# Altium schematic sheet electronic_stopwatch.SchDoc
size A4
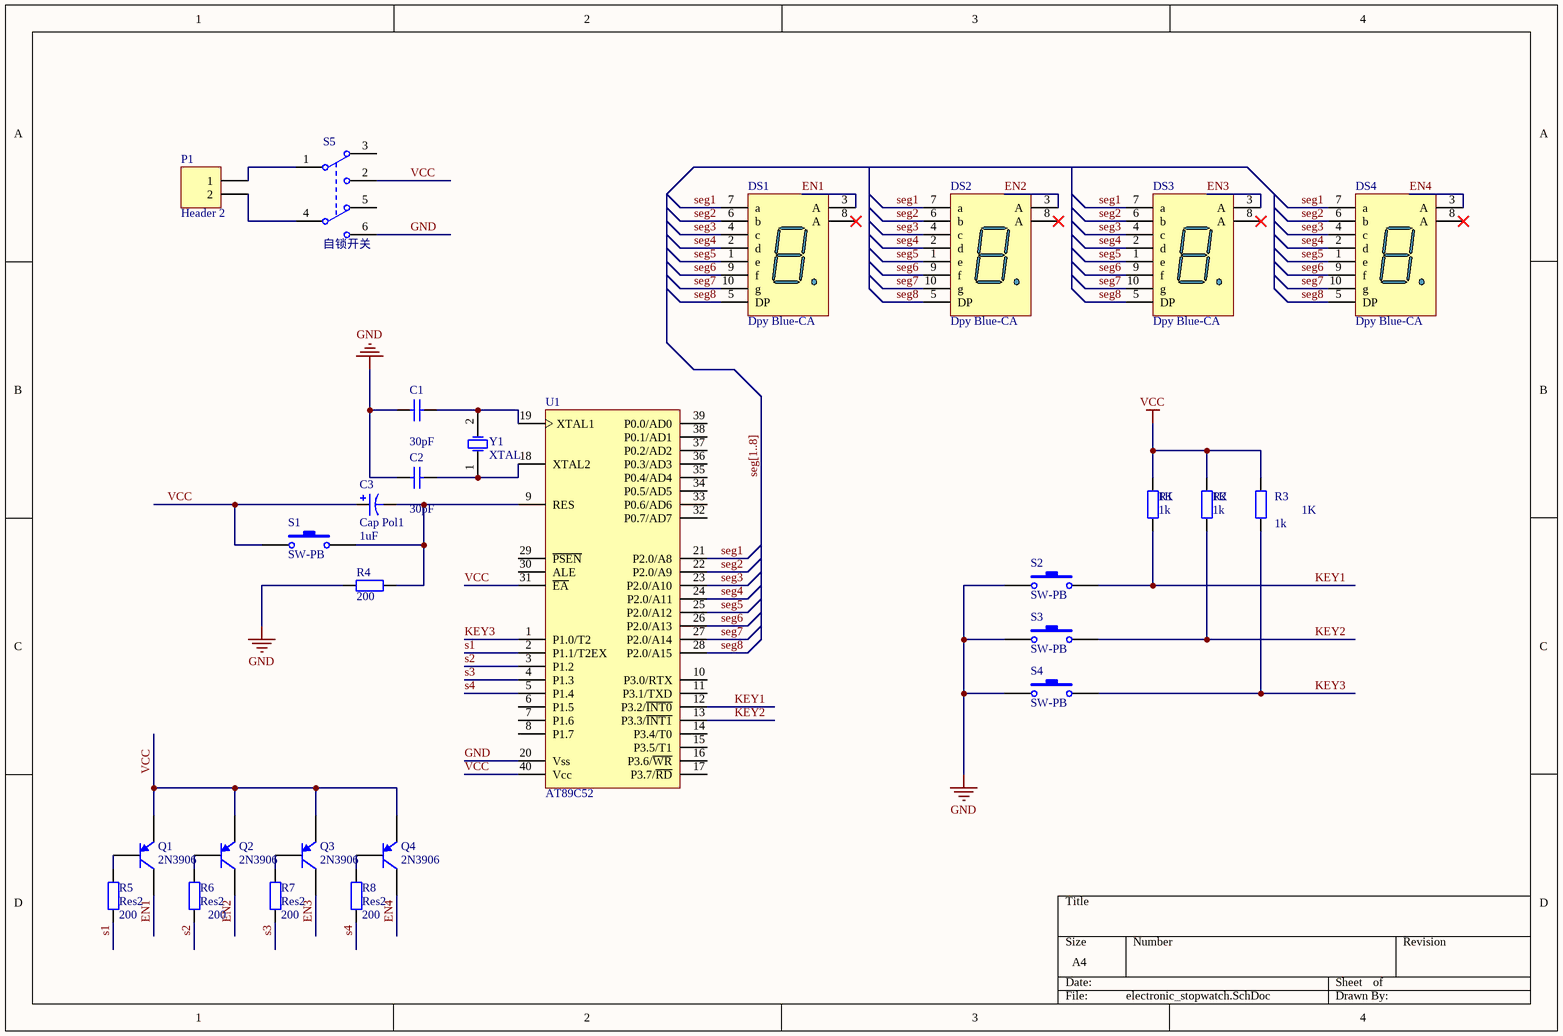
[diagram p0: electronic_stopwatch.SchDoc]

## Parts
C1  value 30pF  [MLCC5.08-A]  (hidden comment: Cap)
C2  value 30pF  [MLCC5.08-A]  (hidden comment: Cap)
C3  Cap Pol1  value 1uF  [CAP 1.5*4*8]
DS1  Dpy Blue-CA  [SEG1_1_5611]
DS2  Dpy Blue-CA  [SEG1_1_5611]
DS3  Dpy Blue-CA  [SEG1_1_5611]
DS4  Dpy Blue-CA  [SEG1_1_5611]
P1  Header 2  [XH2.54-2P]
Q1  2N3906  [to-92]
Q2  2N3906  [to-92]
Q3  2N3906  [to-92]
Q4  2N3906  [to-92]
R1  1K  [RS 1/4W]
R2  1K  [RS 1/4W]
R3  1K  [RS 1/4W]
R4  value 200  [RS 1/4W]
R5  Res2  value 200  [RS 1/4W]
R6  Res2  value 200  [RS 1/4W]
R7  Res2  value 200  [RS 1/4W]
R8  Res2  value 200  [RS 1/4W]
S1  SW-PB  [TSW DIP-6*6*6]
S2  SW-PB  [TSW DIP-6*6*6]
S3  SW-PB  [TSW DIP-6*6*6]
S4  SW-PB  [TSW DIP-6*6*6]
S5  自锁开关  [sw_8.5mm]
U1  AT89C52  [DIP40-600_MH带底座]
Y1  XTAL  [cry卧式]

## Nets
GND: C1.1 C2.1 R4.1 S2.1 S3.1 S4.1 S5.6 U1.20(Vss)
VCC: C3.1 Q1.1(E) Q2.1(E) Q3.1(E) Q4.1(E) R1.1 R2.1 R3.1 S1.1 S5.2 U1.31(~{EA}) U1.40(Vcc)
EN1: DS1.3(A) Q1.3(C)
EN2: DS2.3(A) Q2.3(C)
EN3: DS3.3(A) Q3.3(C)
EN4: DS4.3(A) Q4.3(C)
KEY1: R1.2 S2.2 U1.12(P3.2/~{INT0})
KEY2: R2.2 S3.2 U1.13(P3.3/~{INT1})
KEY3: R3.2 S4.2 U1.1(P1.0/T2)
s1: R5.1 U1.2(P1.1/T2EX)
s2: R6.1 U1.3(P1.2)
s3: R7.1 U1.4(P1.3)
s4: R8.1 U1.5(P1.4)
seg1: DS1.7(a) DS2.7(a) DS3.7(a) DS4.7(a) U1.21(P2.0/A8)
seg2: DS1.6(b) DS2.6(b) DS3.6(b) DS4.6(b) U1.22(P2.0/A9)
seg3: DS1.4(c) DS2.4(c) DS3.4(c) DS4.4(c) U1.23(P2.0/A10)
seg4: DS1.2(d) DS2.2(d) DS3.2(d) DS4.2(d) U1.24(P2.0/A11)
seg5: DS1.1(e) DS2.1(e) DS3.1(e) DS4.1(e) U1.25(P2.0/A12)
seg6: DS1.9(f) DS2.9(f) DS3.9(f) DS4.9(f) U1.26(P2.0/A13)
seg7: DS1.10(g) DS2.10(g) DS3.10(g) DS4.10(g) U1.27(P2.0/A14)
seg8: DS1.5(DP) DS2.5(DP) DS3.5(DP) DS4.5(DP) U1.28(P2.0/A15)
NetC1_2: C1.2 U1.19(XTAL1) Y1.2(OSC2)
NetC2_2: C2.2 U1.18(XTAL2) Y1.1(OSC1)
NetC3_2: C3.2 R4.2 S1.2 U1.9(RES)
NetP1_1: P1.1 S5.1
NetP1_2: P1.2 S5.4
NetQ1_2: Q1.2(B) R5.2
NetQ2_2: Q2.2(B) R6.2
NetQ3_2: Q3.2(B) R7.2
NetQ4_2: Q4.2(B) R8.2

Not connected (* = marked no-connect by the designer): DS1 8(A)*; DS2 8(A)*; DS3 8(A)*; DS4 8(A)*; S5 3 5; U1 6(P1.5) 7(P1.6) 8(P1.7) 10(P3.0/RTX) 11(P3.1/TXD) 14(P3.4/T0) 15(P3.5/T1) 16(P3.6/~{WR}) 17(P3.7/~{RD}) 29(~{PSEN}) 30(ALE) 32(P0.7/AD7) 33(P0.6/AD6) 34(P0.5/AD5) 35(P0.4/AD4) 36(P0.3/AD3) 37(P0.2/AD2) 38(P0.1/AD1) 39(P0.0/AD0)

## Buses and harness runs
bus seg[1..8]

## Library data of the parts
C1 C2 = Cap: Capacitor; Published: 8-Jun-2000; LatestRevisionDate: 17-Jul-2002; LatestRevisionNote: Re-released for DXP Platform.; PackageReference: RAD-0.3; Publisher: Altium Limited
C3 = Cap Pol1: Polarized Capacitor (Radial); Published: 8-Jun-2000; LatestRevisionDate: 17-Jul-2002; LatestRevisionNote: Re-released for DXP Platform.; PackageReference: RB7.6-15; Publisher: Altium Limited
DS1-DS4 = Dpy Blue-CA: 14.2 mm General Purpose Blue 7-Segment Display: CA, RH DP, Gray Surface; MinimumIntensity: 2020 ucd; Note: IF = 10 mA; Published: 8-Jun-2000; LatestRevisionDate: 17-Dec-2003; LatestRevisionNote: Schematic revised, PCB Footprint replaced.; DatasheetDocument: 24-Sep-2002; PackageDocument: 24-Sep-2002; PackageReference: H; Publisher: Altium Limited; Colour: Blue; ComponentLink1Description: Manufacturer Link; ComponentLink1URL: http://www.agilent.com/
P1 = Header 2: Header, 2-Pin; LatestRevisionDate: 17-Jul-2002; LatestRevisionNote: Re-released for DXP Platform.; Publisher: Altium Limited
Q1-Q4 = 2N3906: PNP General Purpose Amplifier; Published: 8-Jun-2000; LatestRevisionDate: 15-Jan-2003; LatestRevisionNote: PCB Footprint 'BCY-W3/D4.7' replaced; DatasheetDocument: 1997; PackageDocument: Sep-1998; PackageReference: TO-92A; Publisher: Altium Limited; Code_JEDEC: TO-92A; ComponentLink1Description: Manufacturer Link; ComponentLink1URL: http://www.fairchildsemi.com/; ComponentLink2Description: Datasheet; ComponentLink2URL: http://www.fairchildsemi.com/ds/2N%2F2N3906.pdf
R1-R8 = Res2: Resistor; Published: 8-Jun-2000; LatestRevisionDate: 17-Jul-2002; LatestRevisionNote: Re-released for DXP Platform.; PackageReference: AXIAL-0.4; Publisher: Altium Limited
  R1-R3: Value: 1k
S1-S4 = SW-PB: Switch; Published: 24-Mar-1999; LatestRevisionDate: 17-Jul-2002; LatestRevisionNote: Re-released for DXP Platform.; PackageReference: SPST-2; Publisher: Altium Limited
S5 = SW DPDT
Y1 = XTAL: Crystal Oscillator; Published: 8-Jun-2000; LatestRevisionDate: 17-Jul-2002; LatestRevisionNote: Re-released for DXP Platform.; PackageReference: R38; Publisher: Altium Limited